# EAGLE design iMacG5-v2 (EAGLE 7.2.0)
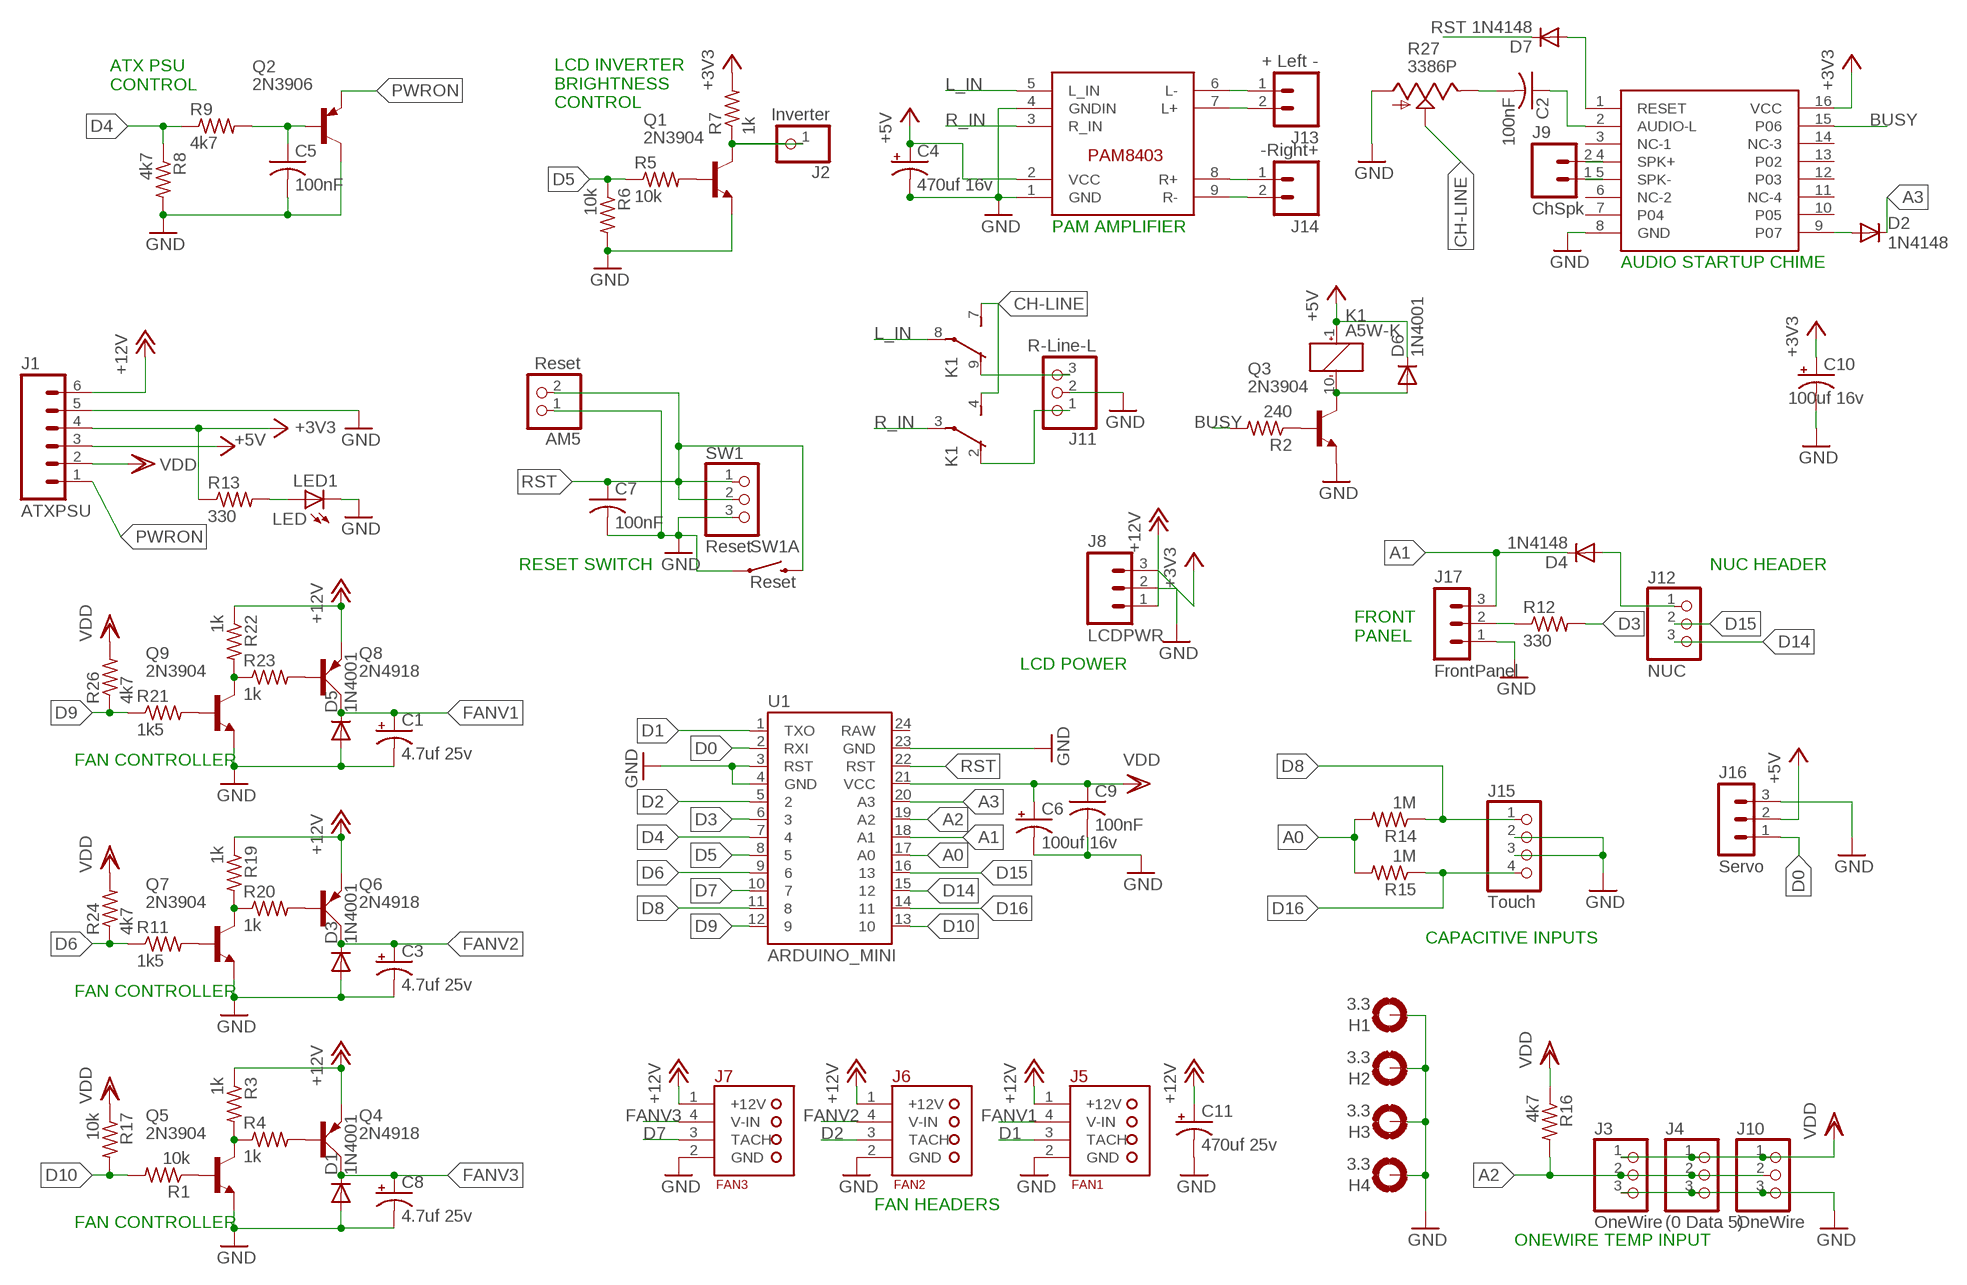
[diagram p0: schematic, sheet 1]

## Parts
AM5  Reset  PINHD-1X2  [1X02]
C1  4.7uf 25v  CPOL-USE2.5-5  [E2,5-5]
C2  100nF  C-US050-024X044  [C050-024X044]
C3  4.7uf 25v  CPOL-USE2.5-5  [E2,5-5]
C4  470uf 16v  CPOL-USE3.5-8  [E3,5-8]
C5  100nF  C-US050-024X044  [C050-024X044]
C6  100uf 16v  CPOL-USE2.5-5  [E2,5-5]
C7  100nF  C-US050-024X044  [C050-024X044]
C8  4.7uf 25v  CPOL-USE2.5-5  [E2,5-5]
C9  100nF  C-US050-024X044  [C050-024X044]
C10  100uf 16v  CPOL-USE2.5-5  [E2,5-5]
C11  470uf 25v  CPOL-USE3.5-8  [E3,5-8]
D1  1N4001  DIODE-D-2.5  [D-2.5]
D2  1N4148  DIODE-D-2.5  [D-2.5]
D3  1N4001  DIODE-D-2.5  [D-2.5]
D4  1N4148  DIODE-D-2.5  [D-2.5]
D5  1N4001  DIODE-D-2.5  [D-2.5]
D6  1N4001  DIODE-D-7.5  [D-7.5]
D7  1N4148  1N4148DO35-7  [DO35-7]
H1  3.3  MOUNT-PAD-ROUND3.3  [3,3-PAD]
H2  3.3  MOUNT-PAD-ROUND3.3  [3,3-PAD]
H3  3.3  MOUNT-PAD-ROUND3.3  [3,3-PAD]
H4  3.3  MOUNT-PAD-ROUND3.3  [3,3-PAD]
J1  ATXPSU  M06POLAR  [MOLEX-1X6]
J2  Inverter  PINHD-1X1  [1X01]
J3  OneWire  PINHD-1X3  [1X03]
J4  (0 Data 5)  PINHD-1X3  [1X03]
J5  FAN1  IMAC-G5-FAN-2X3IMAC_G5_1X4  [MOLEX-1X4]
J6  FAN2  IMAC-G5-FAN-2X3  [IMAC_G5_2X3]
J7  FAN3  IMAC-G5-FAN-2X3  [IMAC_G5_2X3]
J8  LCDPWR  M03POLAR  [MOLEX-1X3]
J9  ChSpk  M02POLAR  [MOLEX-1X2]
J10  OneWire  PINHD-1X3  [1X03]
J11  R-Line-L  PINHD-1X3  [1X03]
J12  NUC  PINHD-1X3  [1X03]
J13  + Left -  M02POLAR  [MOLEX-1X2]
J14  -Right+  M02POLAR  [MOLEX-1X2]
J15  Touch  PINHD-1X4  [1X04]
J16  Servo  MA03-1  [MA03-1]
J17  FrontPanel  MA03-1  [MA03-1]
K1  A5W-K  TQ2-5V  [TQ2]
LED1  LED  LED3MM  [LED3MM]
Q1  2N3904  [TO92]
Q2  2N3906  [TO92]
Q3  2N3904  [TO92]
Q4  2N4918  BD438  [TO126AV]
Q5  2N3904  [TO92]
Q6  2N4918  BD438  [TO126AV]
Q7  2N3904  [TO92]
Q8  2N4918  BD438  [TO126AV]
Q9  2N3904  [TO92]
R1  10k  R-US_0207/7  [0207/7]
R2  240  R-US_0207/2V  [0207/2V]
R3  1k  R-US_0207/2V  [0207/2V]
R4  1k  R-US_0207/2V  [0207/2V]
R5  10k  R-US_0207/2V  [0207/2V]
R6  10k  R-US_0207/2V  [0207/2V]
R7  1k  R-US_0207/2V  [0207/2V]
R8  4k7  R-US_0207/2V  [0207/2V]
R9  4k7  R-US_0207/2V  [0207/2V]
R11  1k5  R-US_0207/2V  [0207/2V]
R12  330  R-US_0207/2V  [0207/2V]
R13  330  R-US_0207/2V  [0207/2V]
R14  1M  R-US_0207/7  [0207/7]
R15  1M  R-US_0207/7  [0207/7]
R16  4k7  R-US_0207/7  [0207/7]
R17  10k  R-US_0207/7  [0207/7]
R19  1k  R-US_0207/2V  [0207/2V]
R20  1k  R-US_0207/2V  [0207/2V]
R21  1k5  R-US_0207/2V  [0207/2V]
R22  1k  R-US_0207/2V  [0207/2V]
R23  1k  R-US_0207/2V  [0207/2V]
R24  4k7  R-US_0207/2V  [0207/2V]
R26  4k7  R-US_0207/2V  [0207/2V]
R27  3386P  TRIM_US-B25P  [B25P]
SW1  Reset  PINHD-1X3  [1X03]
SW1A  Reset  SWITCH-MOMENTARY-2PTH  [TACTILE-PTH]
U1  ARDUINO_MINI  [ARDUINO_MINI]
U2  PAM8403  [PAM8403]
U3  WTV020-SD-16P  [WTV020-SD-16P]

## Nets
+3V3 [power]: C10.+ J1.4 J8.3 R7.2 R13.1 U3.16(VCC)
+5V [power]: C4.+ D6.C J1.3 J16.2 K1.1(_:+) U2.2(VCC)
+12V [power]: C11.+ J1.6 J5.1(+12V) J6.1(+12V) J7.1(+12V) J8.1 Q4.E Q6.E Q8.E R3.1 R19.1 R22.1
A0: R14.2 R15.2 U1.17(A0)
A1: D4.C J17.3 U1.18(A1)
A2: J3.2 J4.2 J10.2 R16.2 U1.19(A2)
A3: D2.C U1.20(A3)
BUSY: R2.2 U3.15(P06)
CH-LINE: K1.4(1:S) K1.7(2:S) R27.S
D0: J16.1 U1.2(RXI)
D1: J5.3(TACH) U1.1(TXO)
D2: J6.3(TACH) U1.5
D3: R12.2 U1.6
D4: R8.1 R9.1 U1.7
D5: R5.1 R6.1 U1.8
D6: R11.1 R24.1 U1.9
D7: J7.3(TACH) U1.10
D8: J15.1 R14.1 U1.11
D9: R21.1 R26.1 U1.12
D10: R1.2 R17.2 U1.13
D14: J12.3 U1.15
D15: J12.2 U1.16
D16: J15.4 R15.1 U1.14
FANV1: C1.+ D5.C J5.4(V-IN) Q8.C
FANV2 [power]: C3.+ D3.C J6.4(V-IN) Q6.C
FANV3 [power]: C8.+ D1.C J7.4(V-IN) Q4.C
GND [power]: AM5.1 C1.- C3.- C4.- C5.2 C6.- C7.2 C8.- C9.2 C10.- C11.- D1.A D3.A D5.A H1.B3,3(MOUNT) H2.B3,3(MOUNT) H3.B3,3(MOUNT) H4.B3,3(MOUNT) J1.5 J3.3 J4.3 J5.2(GND) J6.2(GND) J7.2(GND) J8.2 J10.3 J11.2 J15.2 J15.3 J16.3 J17.1 LED1.K(C) Q1.3(E) Q2.1(C) Q3.3(E) Q5.3(E) Q7.3(E) Q9.3(E) R6.2 R8.2 R27.A SW1.3 SW1A.1 U1.3(RST) U1.4(GND) U1.23(GND) U2.1(GND) U2.4(GNDIN) U3.8(GND)
L_IN: K1.8(2:P) U2.5(L_IN)
N$1: D4.A J12.1
N$2 [power]: D6.A K1.10(_:-) Q3.1(C)
N$3: Q1.2(B) R5.2
N$4: Q4.B R4.2
N$5: Q5.1(C) R3.2 R4.1
N$6: J2.1 Q1.1(C) R7.1
N$7: J9.1 U3.5(SPK-)
N$9: J9.2 U3.4(SPK+)
N$10: J17.2 R12.1
N$12: J14.1 U2.8(R+)
N$13: D7.A U3.1(RESET)
N$15: C2.2 R27.E
N$16: J14.2 U2.9(R-)
N$17: Q5.2(B) R1.1
N$18: J13.2 U2.7(L+)
N$19: Q6.B R20.2
N$20: LED1.A R13.2
N$21: J11.3 K1.9(2:O)
N$22: J11.1 K1.2(1:O)
N$23: Q3.2(B) R2.1
N$25: D2.A U3.9(P07)
N$26: J13.1 U2.6(L-)
N$27: Q7.1(C) R19.2 R20.1
N$28: Q7.2(B) R11.2
N$29: Q8.B R23.2
N$30: Q9.1(C) R22.2 R23.1
N$31: Q9.2(B) R21.2
N$32: C5.1 Q2.2(B) R9.2
N$33: C2.1 U3.2(AUDIO-L)
PWRON: J1.1 Q2.3(E)
R_IN: K1.3(1:P) U2.3(R_IN)
RST: AM5.2 C7.1 D7.C SW1.1 SW1.2 SW1A.3 U1.22(RST)
VDD [power]: C6.+ C9.1 J1.2 J3.1 J4.1 J10.1 R16.1 R17.1 R24.2 R26.2 U1.21(VCC)
Unconnected: U1.24(RAW) U3.3(NC-1) U3.6(NC-2) U3.7(P04) U3.10(P05) U3.11(NC-4) U3.12(P03) U3.13(P02) U3.14(NC-3)

## Notes on the sheet
- ATX PSU
  CONTROL
- LCD INVERTER
  BRIGHTNESS 
  CONTROL
- PAM AMPLIFIER
- AUDIO STARTUP CHIME
- RESET SWITCH | NUC HEADER
- FRONT
  PANEL
- LCD POWER
- FAN CONTROLLER
- CAPACITIVE INPUTS
- FAN CONTROLLER
- FAN HEADERS
- FAN CONTROLLER
- ONEWIRE TEMP INPUT

## Library data of the parts
AM5 = pinhead:PINHD-1X2: PIN HEADER
C1 C3 C4 C6 C8 C10 C11 = rcl:CPOL-US: POLARIZED CAPACITOR, American symbol
C2 C5 C7 C9 = rcl:C-US: CAPACITOR, American symbol
D1-D6 = diode:DIODE-: DIODE
D7 = diode:1N4148: DIODE high speed (Philips)
H1-H4 = holes:MOUNT-PAD-ROUND: MOUNTING PAD, round
J1 = SparkFun-Connectors:M06: Header 6 Standard 6-pin 0.1" header. Use with straight break away headers (SKU : PRT-00116), right angle break away headers (PRT-00553), swiss pins (PRT-00743), machine pins (PRT-00117), and female headers (PRT-00115). Molex polarized connector foot print use with SKU : PRT-08094 with associated crimp pins and housings. NOTES ON THE VARIANTS LOCK and LOCK_LONGPADS... This footprint was designed to help hold the alignment of a through-hole component (i.e. 6-pin header) while soldering it into place. You may notice that each hole has been shifted either up or down by 0.005 of an inch from it's more standard position (which is a perfectly straight line). This slight alteration caused the pins (the squares in the middle) to touch the edges of the holes. Because they are alternating, it causes a "brace" to hold the component in place. 0.005 has proven to be the perfect amount of "off-center" position when using our standard breakaway headers. Although looks a little odd when you look at the bare footprint, once you have a header in there, the alteration is very hard to notice. Also,if you push a header all the way into place, it is covered up entirely on the bottom side. This idea of altering the position of holes to aid alignment will be further integrated into the Sparkfun Library for other footprints. It can help hold any component with 3 or more connection pins.
J2 = pinhead:PINHD-1X1: PIN HEADER
J3 J4 J10-J12 SW1 = pinhead:PINHD-1X3: PIN HEADER
J5-J7 = 00_custom:IMAC-G5-FAN-2X3: Apple iMac G5 17 and 20 Inch Fan Connector
J8 = SparkFun-Connectors:M03: Header 3 Standard 3-pin 0.1" header. Use with straight break away headers (SKU : PRT-00116), right angle break away headers (PRT-00553), swiss pins (PRT-00743), machine pins (PRT-00117), and female headers (PRT-00115). Molex polarized connector foot print use with SKU : PRT-08232 with associated crimp pins and housings.
J9 J13 J14 = SparkFun-Connectors:M02: Standard 2-pin 0.1" header. Use with - straight break away headers ( PRT-00116) - right angle break away headers (PRT-00553) - swiss pins (PRT-00743) - machine pins (PRT-00117) - female headers (PRT-00115) Molex polarized connector foot print use with: PRT-08233 with associated crimp pins and housings. 2.54_SCREWTERM for use with PRT-10571. 3.5mm Screw Terminal footprints for PRT-08084 5mm Screw Terminal footprints for use with PRT-08432
J15 = pinhead:PINHD-1X4: PIN HEADER
J16 J17 = con-lstb:MA03-1: PIN HEADER; OC_FARNELL: unknown; OC_NEWARK: unknown
K1 = relay:TQ2?*: LOW PROFILE 2 FORM C RELAY NAiS Source: http://www.mew-europe.com/.. en_ds_61020_0001.pdf Source: http://www.mew-europe.com/.. en_ds_61020_0004.pdf; MF: AROMAT/ MATSUSHITA; MPN: TQ2-5V; OC_FARNELL: 1175716; OC_NEWARK: 64K3200
LED1 = led:LED: LED OSRAM: - CHIPLED LG R971, LG N971, LY N971, LG Q971, LY Q971, LO R971, LY R971 LH N974, LH R974 LS Q976, LO Q976, LY Q976 LO Q996 - Hyper CHIPLED LW Q18S LB Q993, LB Q99A, LB R99A - SideLED LS A670, LO A670, LY A670, LG A670, LP A670 LB A673, LV A673, LT A673, LW A673 LH A674 LY A675 LS A676, LA A676, LO A676, LY A676, LW A676 LS A679, LY A679, LG A679 - Hyper Micro SIDELED® LS Y876, LA Y876, LO Y876, LY Y876 LT Y87S - SmartLED LW L88C, LW L88S LB L89C, LB L89S, LG L890 LS L89K, LO L89K, LY L89K LS L896, LA L896, LO L896, LY L896 - TOPLED LS T670, LO T670, LY T670, LG T670, LP T670 LSG T670, LSP T670, LSY T670, LOP T670, LYG T670 LG T671, LOG T671, LSG T671 LB T673, LV T673, LT T673, LW T673 LH T674 LS T676, LA T676, LO T676, LY T676, LB T676, LH T676, LSB T676, LW T676 LB T67C, LV T67C, LT T67C, LS T67K, LO T67K, LY T67K, LW E67C LS E67B, LA E67B, LO E67B, LY E67B, LB E67C, LV E67C, LT E67C LW T67C LS T679, LY T679, LG T679 LS T770, LO T770, LY T770, LG T770, LP T770 LB T773, LV T773, LT T773, LW T773 LH T774 LS E675, LA E675, LY E675, LS T675 LS T776, LA T776, LO T776, LY T776, LB T776 LHGB T686 LT T68C, LB T68C - Hyper Mini TOPLED® LB M676 - Mini TOPLED Santana® LG M470 LS M47K, LO M47K, LY M47K Source: http://www.osram.convergy.de LUXEON: - LUMILED® LXK2-PW12-R00, LXK2-PW12-S00, LXK2-PW14-U00, LXK2-PW14-V00 LXK2-PM12-R00, LXK2-PM12-S00, LXK2-PM14-U00 LXK2-PE12-Q00, LXK2-PE12-R00, LXK2-PE12-S00, LXK2-PE14-T00, LXK2-PE14-U00 LXK2-PB12-K00, LXK2-PB12-L00, LXK2-PB12-M00, LXK2-PB14-N00, LXK2-PB14-P00, LXK2-PB14-Q00 LXK2-PR12-L00, LXK2-PR12-M00, LXK2-PR14-Q00, LXK2-PR14-R00 LXK2-PD12-Q00, LXK2-PD12-R00, LXK2-PD12-S00 LXK2-PH12-R00, LXK2-PH12-S00 LXK2-PL12-P00, LXK2-PL12-Q00, LXK2-PL12-R00 Source: www.luxeon.com KINGBRIGHT: KA-3528ASYC Source: www.kingbright.com
Q1 Q3 Q5 Q7 Q9 = transistor:2N3904: NPN TRANSISTOR
Q2 = transistor-pnp:2N3906: PNP Transistor
Q4 Q6 Q8 = transistor-power:BD438: PNP TRANSISTOR
R1 R14-R17 = rcl:R-US_: RESISTOR, American symbol
R2-R9 R11-R13 R19-R24 R26 = resistor:R-US_: RESISTOR, American symbol
R27 = pot:TRIM_US-: POTENTIOMETER
SW1A = SparkFun-Electromechanical:SWITCH-MOMENTARY-2: Various NO switches- pushbuttons, reed, etc
U1 = SparkFun-Boards:ARDUINO_MINI: Arduino Pro Mini footprint
U2 = 00_custom:PAM8403
U3 = 00_custom:WTV020-SD-16P

## Net classes
1 power: width 0.051 mm

## Board
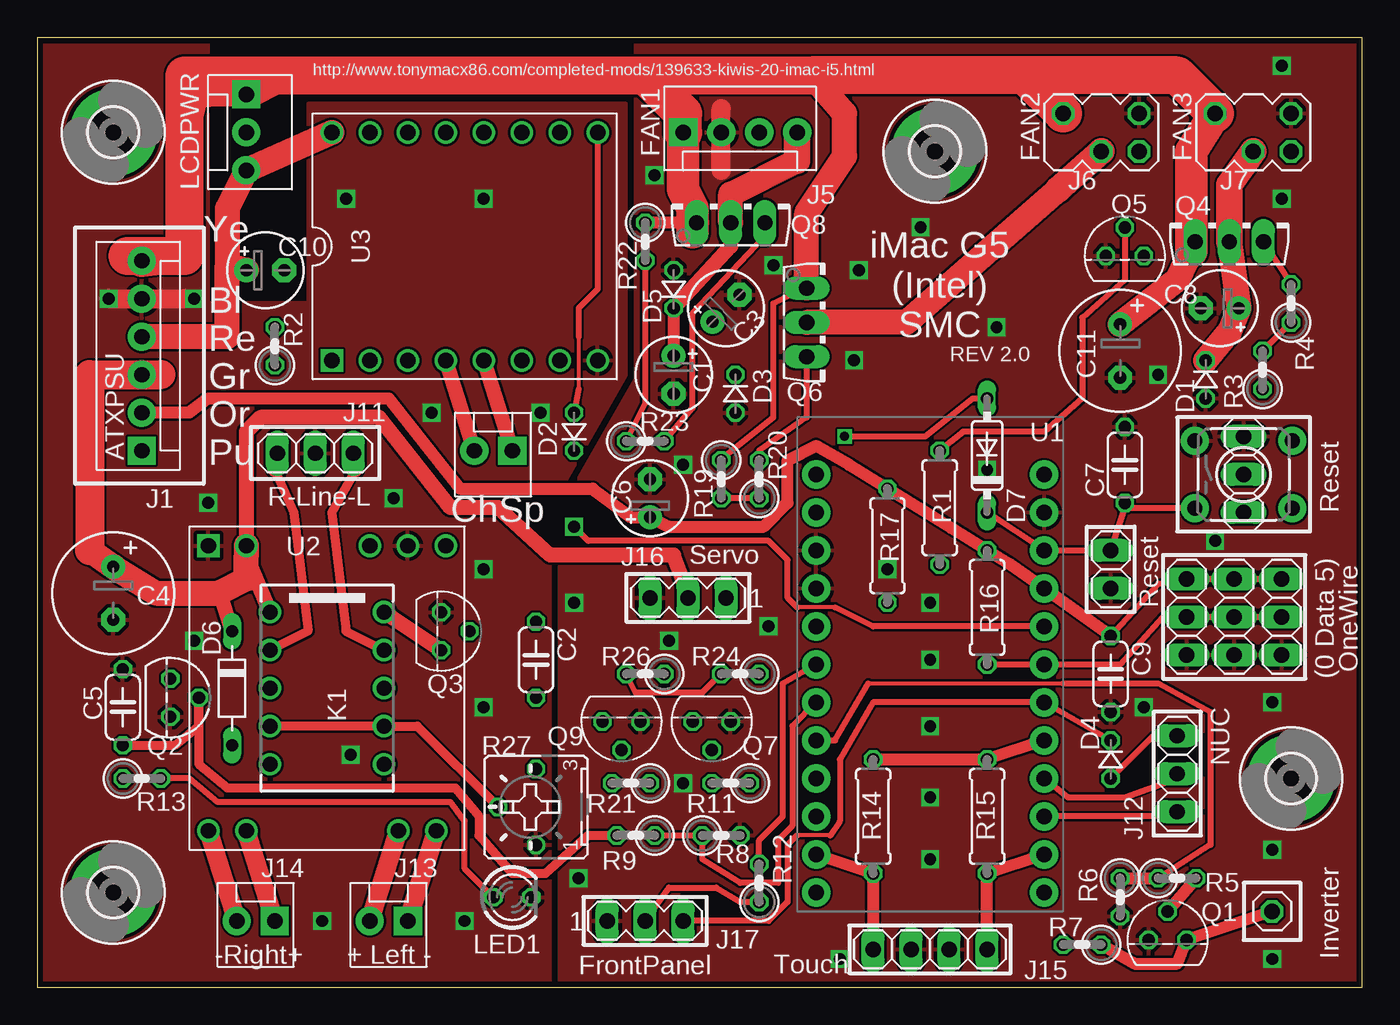
[diagram p1: board, top side]
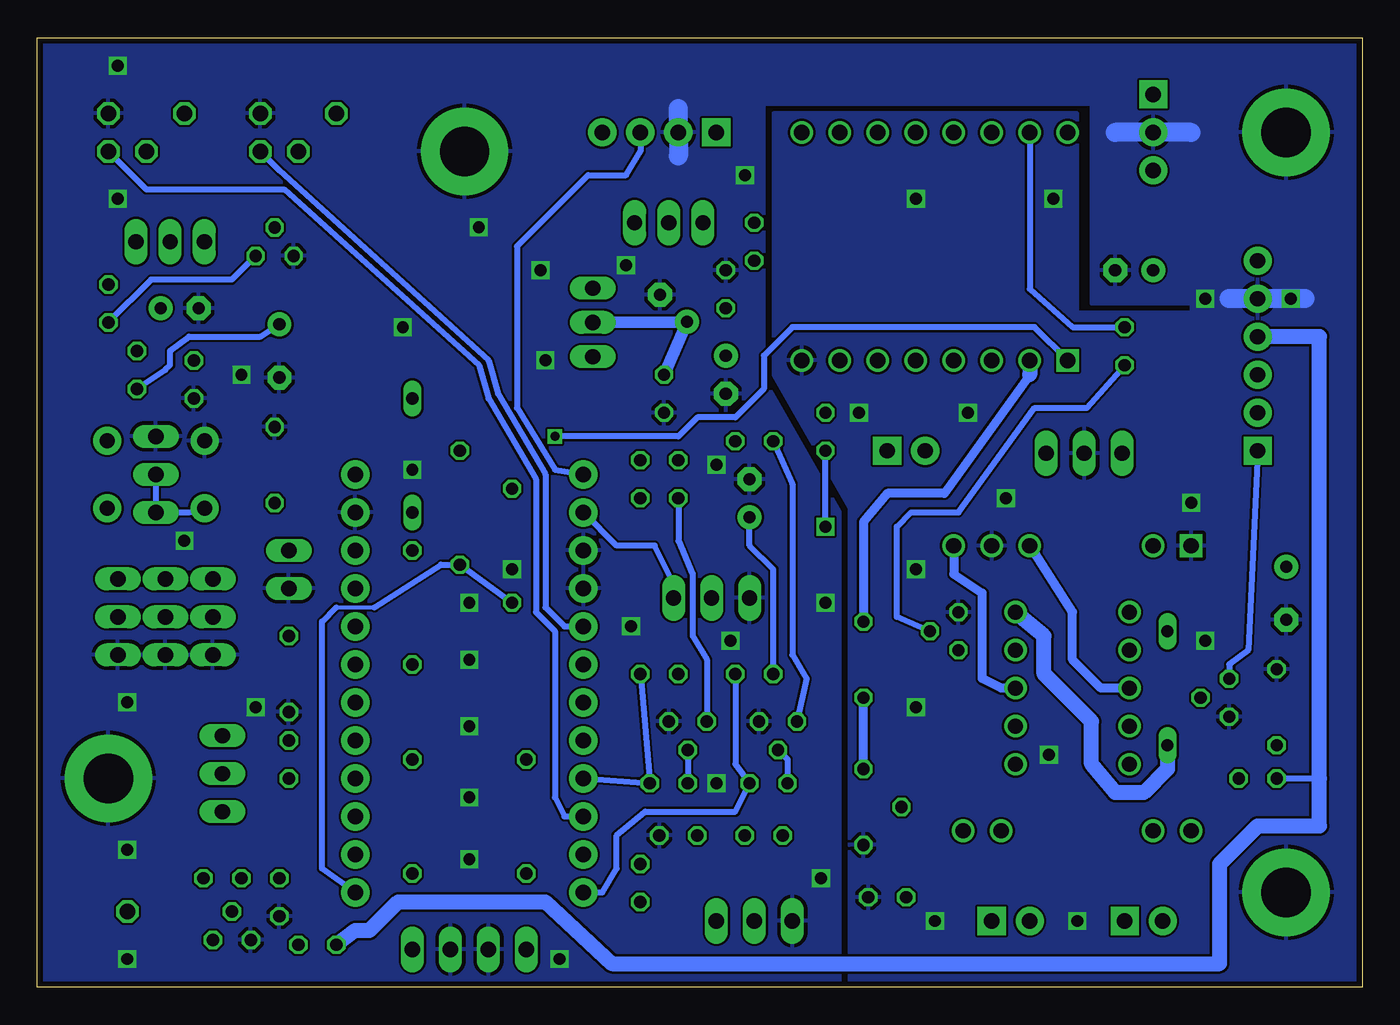
[diagram p2: board, bottom side, seen from below]

Size 88.57 x 63.49 mm. Coordinates in mm from the lower left corner, seen from the top.
Outline: 0,0 88.57,0 88.57,63.49 0,63.49 0,0
Copper layers (1*16): Top 0.0356mm / dielectric 1.5011mm / Bottom 0.0356mm
Design rules "default *": minimum track width 6mil, minimum drill 13mil, track to track 6mil, track to pad 6mil, pad to pad 6mil, via to via 6mil, smd to smd 6mil, copper to edge 15mil, drill to drill 6mil, minimum pad ring 7mil, minimum via ring 7mil, stop-mask expansion 3mil, vias tented up to drill 0mil, thermal gap 10mil

### Footprints (pad centres in the part's own frame; a part is rotated, then mirrored left to right if it is on the bottom)
1X02 = drill 1.016 long: 1 -1.27,0; 2 1.27,0
E2,5-5 = drill 0.813 pad 1.6: + -1.27,0 | drill 0.813 pad 1.6 octagon: - 1.27,0
C050-024X044 = drill 0.813 octagon: 1 -2.54,0; 2 2.54,0
E3,5-8 = drill 0.813 pad 1.6: + -1.778,0 | drill 0.813 pad 1.6 octagon: - 1.778,0
D-2.5 = drill 0.813 octagon: A 1.27,0; C -1.27,0
D-7.5 = drill 0.813 long: A 3.81,0; C -3.81,0
DO35-7 = drill 0.813 long: A 3.81,0; C -3.81,0
3,3-PAD = drill 3.3 pad 5.842: B3,3 0,0
MOLEX-1X6 = drill 1.016 pad 1.88 square: 1 0,0 | drill 1.016 pad 1.88: 2 2.54,0; 3 5.08,0; 4 7.62,0; 5 10.16,0; 6 12.7,0
1X01 = drill 1.016 octagon: 1 0,0
1X03 = drill 1.016 long: 1 -2.54,0; 2 0,0; 3 2.54,0
MOLEX-1X4 = drill 1.016 pad 1.88 square: 1 0,0 | drill 1.016 pad 1.88: 2 2.54,0; 3 5.08,0; 4 7.62,0
IMAC_G5_2X3 = drill 1.016 octagon: 1 -2.54,1.27; 2 2.54,1.27; 3 2.54,-1.27; 4 0,-1.27
MOLEX-1X3 = drill 1.016 pad 1.88 square: 1 0,0 | drill 1.016 pad 1.88: 2 2.54,0; 3 5.08,0
MOLEX-1X2 = drill 1.016 pad 1.88 square: 1 0,0 | drill 1.016 pad 1.88: 2 2.54,0
1X04 = drill 1.016 long: 1 -3.81,0; 2 -1.27,0; 3 1.27,0; 4 3.81,0
MA03-1 = drill 1.016 long: 1 -2.54,0; 2 0,0; 3 2.54,0
TQ2 = drill 1: 1 -5.08,-3.81; 2 -2.54,-3.81; 3 0,-3.81; 4 2.54,-3.81; 5 5.08,-3.81; 6 5.08,3.81; 7 2.54,3.81; 8 0,3.81; 9 -2.54,3.81; 10 -5.08,3.81
LED3MM = drill 0.813 octagon: A -1.27,0; K 1.27,0
TO92 = drill 0.813 octagon: 1 1.27,0; 2 0,1.905; 3 -1.27,0
TO126AV = drill 1.016 long: B 2.286,-1.27; C 0,-1.27; E -2.286,-1.27
0207/7 = drill 0.813 octagon: 1 -3.81,0; 2 3.81,0
0207/2V = drill 0.813 octagon: 1 -1.27,0; 2 1.27,0
B25P = drill 0.813 octagon: A -2.54,0; E 2.54,0; S 0,2.54
TACTILE-PTH = drill 1.016 pad 1.88: 1 -3.251,2.261; 2 3.251,2.261; 3 -3.251,-2.261; 4 3.251,-2.261
ARDUINO_MINI = drill 1.016 pad 1.88: 1 -7.62,12.7; 2 -7.62,10.16; 3 -7.62,7.62; 4 -7.62,5.08; 5 -7.62,2.54; 6 -7.62,0; 7 -7.62,-2.54; 8 -7.62,-5.08; 9 -7.62,-7.62; 10 -7.62,-10.16; 11 -7.62,-12.7; 12 -7.62,-15.24; 13 7.62,-15.24; 14 7.62,-12.7; 15 7.62,-10.16; 16 7.62,-7.62; 17 7.62,-5.08; 18 7.62,-2.54; 19 7.62,0; 20 7.62,2.54; 21 7.62,5.08; 22 7.62,7.62; 23 7.62,10.16; 24 7.62,12.7
PAM8403 = drill 1.016 square: 1 -7.62,8.89 | drill 1.016: 2 -5.08,8.89; 3 3.175,8.89; 4 5.715,8.89; 5 8.255,8.89; 6 7.62,-10.16; 7 5.08,-10.16; 8 -5.08,-10.16; 9 -7.62,-10.16
WTV020-SD-16P = drill 1.016 square: 1 -7.62,8.89 | drill 1.016: 2 -7.62,6.35; 3 -7.62,3.81; 4 -7.62,1.27; 5 -7.62,-1.27; 6 -7.62,-3.81; 7 -7.62,-6.35; 8 -7.62,-8.89; 9 7.62,-8.89; 10 7.62,-6.35; 11 7.62,-3.81; 12 7.62,-1.27; 13 7.62,1.27; 14 7.62,3.81; 15 7.62,6.35; 16 7.62,8.89

### Placement (x,y rotation side)
AM5  71.75,27.94 90 top
C1  42.55,40.96 270 top
C2  33.34,21.91 270 top
C3  46.04,45.4 45 top
C4  5.08,26.35 270 top
C5  5.71,18.73 90 top
C6  40.96,32.7 90 top
C7  72.71,34.92 90 top
C8  79.06,45.4 180 top
C9  71.75,20.95 270 top
C10  15.24,47.94 0 top
C11  72.39,42.55 270 top
D1  78.11,40.64 270 top
D2  35.88,37.15 90 top
D3  46.67,39.69 270 top
D4  71.75,15.24 270 top
D5  42.55,46.67 90 top
D6  13.02,20 270 top
D7  63.5,35.56 90 top
H1  5.08,6.35 0 top
H2  83.82,13.97 0 top
H3  5.08,57.15 0 top
H4  60.01,55.88 0 top
J1  6.99,35.88 90 top
J2  82.55,5.08 0 top
J3  76.83,24.77 270 top
J4  80.01,24.77 270 top
J5  43.18,57.15 0 top
J6  71.12,57.15 0 top
J7  81.28,57.15 0 top
J8  13.97,59.69 270 top
J9  31.75,35.88 180 top
J10  83.19,24.77 270 top
J11  18.58,35.7 0 top
J12  76.2,14.29 270 top
J13  24.77,4.45 180 top
J14  15.88,4.45 180 top
J15  59.69,2.54 0 top
J16  43.5,26.04 180 top
J17  40.64,4.45 0 top
K1  19.37,20 270 top
LED1  31.75,6.03 0 top
Q1  75.56,3.17 0 top
Q2  8.89,19.37 270 top
Q3  26.99,23.81 270 top
Q4  79.69,51.12 0 top
Q5  72.71,48.9 0 top
Q6  52.7,44.45 270 top
Q7  45.09,17.78 180 top
Q8  46.35,52.39 0 top
Q9  39.05,17.78 180 top
R1  60.33,32.07 270 top
R2  15.88,42.86 90 top
R3  81.92,41.27 90 top
R4  83.82,45.72 90 top
R5  76.2,7.3 0 top
R6  72.39,6.03 270 top
R7  69.85,2.86 180 top
R8  45.72,10.16 0 top
R9  40.01,10.16 180 top
R11  46.35,13.65 180 top
R12  48.26,6.99 90 top
R13  6.99,13.97 0 top
R14  55.88,11.43 90 top
R15  63.5,11.43 90 top
R16  63.5,25.4 270 top
R17  56.83,29.53 270 top
R19  45.72,33.97 270 top
R20  48.26,33.97 90 top
R21  39.69,13.65 180 top
R22  40.64,49.85 270 top
R23  40.64,36.51 0 top
R24  46.99,20.95 180 top
R26  40.64,20.95 180 top
R27  33.34,12.06 90 top
SW1  80.64,34.29 90 top
SW1A  80.64,34.29 0 top
U1  59.69,21.59 0 top
U2  19.05,20.64 0 top
U3  28.57,49.53 90 top

### Tracks (layer width: path | path; a pad name or v marks a point on that pad's centre or on a via)
+3V3
  Top 1.676: 12.7,48.26 12.7,43.5 J1.4 | C10.+ 12.7,48.26 | U3.16 J8.3 12.7,52.07 12.7,48.26
  Bottom 0.406: R13.1 2.86,13.97
  Bottom 1.016: R7.2 67.31,3.81 66.36,3.81 64.45,5.71 54.61,5.71 50.16,1.59 9.53,1.59 9.53,8.26 6.99,10.79 2.86,10.79 2.86,13.97 2.86,43.5 J1.4
+5V
  Top 0.813: J16.2 43.5,26.35
  Top 1.016: 43.5,26.35 42.55,28.89 34.29,28.89 30.8,32.07 27.62,32.07 22.86,38.1 14.92,38.1 13.97,37.15 U2.2 | K1.1 13.97,28.89 | D6.C 12.19,26.42
  Top 1.676: 3.49,29.21 C4.+ 7.94,26.35 12.06,26.35 12.19,26.42 13.97,27.3 13.97,28.89 U2.2
  Top 1.93: 3.49,29.21 3.49,40.96 J1.3 8.26,40.96
+12V
  Top 0.406: R19.1 46.04,35.56 49.21,38.1 49.21,45.72 50.48,46.35 Q6.E
  Top 0.813: Q8.E R22.1
  Top 1.676: 43.81,50.48 Q8.E | 77.15,49.21 Q4.E 76.2,47.31 C11.+ | Q6.E 51.44,51.75 53.98,55.56 53.98,58.42 51.75,60.96 | 11.43,59.69 J8.1 13.97,60.01
  Top 2.184: 9.84,48.9 J1.6 | 43.81,50.48 43.81,52.07 43.18,53.34 J5.1 | 77.15,49.21 77.15,55.88 J7.1
  Top 2.54: 10.16,59.69 9.84,58.42 | 15.88,60.96 40.64,60.96 | 40.64,60.96 51.75,60.96 66.04,60.96 | 66.04,60.96 76.2,60.96 J7.1 | 6.03,48.9 9.84,48.9 9.84,58.42 | 9.84,58.42 9.84,60.96 15.88,60.96 | 13.97,60.01 15.88,60.96 | J6.1 66.04,60.96 | J5.1 43.18,58.42 40.64,60.96
  Bottom 0.406: R3.1 80.01,41.27 79.69,41.59 79.69,42.55 78.42,43.5 73.66,43.5 C11.+
A0
  Top 0.813: U1.17 R15.2 R14.2
A1
  Top 0.254: 53.02,10.16 50.8,10.16
  Top 0.406: 53.02,10.16 53.66,11.11 53.66,15.24 55.88,19.05 U1.18 D4.C | 50.8,10.16 50.16,9.53 50.16,5.71 48.9,4.45 J17.3
A2
  Top 0.406: J10.2 J4.2 J3.2 75.25,24.77 72.39,21.59 U1.19 R16.2
A3  (via drill 0.8)
  Top 0.254: 53.34,25.4 50.8,25.4
  Top 0.406: U1.20 55.88,24.13 53.34,25.4 | 50.8,25.4 50.16,26.04 50.16,28.57 48.9,29.84 36.83,29.84 v35.88,30.8
  Bottom 0.406: v35.88,30.8 D2.C
BUSY
  Bottom 0.406: R2.2 19.37,44.13 22.23,46.67 U3.15
CH-LINE
  Top 0.61: K1.4 K1.7 25.4,17.46 R27.S
D0
  Bottom 0.406: J16.1 46.04,26.99 47.31,29.53 49.85,29.53 U1.2
D1
  Bottom 0.406: U1.1 53.98,34.61 56.52,38.73 56.52,49.53 51.75,54.29 49.21,54.29 48.26,55.88 J5.3
D2
  Bottom 0.406: U1.5 53.34,24.13 54.61,25.4 54.61,34.29 57.78,39.69 58.42,41.91 72.39,54.61 J6.3
D3
  Top 0.406: R12.2 48.26,9.84 49.85,11.43 49.85,20.32 U1.6
D4
  Top 0.406: U1.7 50.48,17.46 50.48,10.79 49.53,9.84 49.53,6.99 46.99,6.99 44.45,8.57 R8.1 R9.1
D5
  Top 0.254: 55.56,20.32 68.58,20.32
  Top 0.406: U1.8 53.34,16.51 55.56,20.32 | 68.58,20.32 74.93,20.32 78.42,18.41 78.42,9.53 R5.1
  Top 0.813: R6.1 R5.1
D6
  Bottom 0.406: U1.9 R11.1 R24.1
D7
  Bottom 0.406: U1.10 53.34,11.43 53.98,12.7 53.98,23.81 55.24,25.08 55.24,33.97 58.42,39.37 59.05,41.59 72.07,53.34 81.28,53.34 J7.3
D8
  Top 0.813: U1.11 R14.1 J15.1
D9
  Bottom 0.406: R26.1 41.91,14.92 R21.1 41.91,11.75 47.94,11.75 49.85,10.16 49.85,7.94 50.8,6.35 U1.12
D10
  Bottom 0.254: 68.58,25.4 66.04,25.4
  Bottom 0.406: U1.13 69.53,7.94 69.53,24.45 68.58,25.4 | 66.04,25.4 61.59,28.26 R1.2 R17.2
D14
  Top 0.406: J12.3 74.61,11.43 U1.15
D15
  Top 0.406: U1.16 68.9,12.7 72.71,12.7 76.2,13.97 J12.2
D16
  Top 0.813: J15.4 R15.1 U1.14
FANV1
  Top 0.813: D5.C C1.+
  Top 1.016: Q8.C 46.35,49.53 D5.C
  Top 1.676: Q8.C 46.35,53.02 50.8,55.24
  Top 1.778: J5.4 50.8,55.24
FANV2
  Top 1.676: 68.26,53.34 58.1,44.45 Q6.C
  Top 1.778: J6.4 68.26,53.34
  Bottom 0.813: Q6.C C3.+ D3.C
FANV3
  Top 1.676: Q4.C C8.+ 79.69,43.81 D1.C
  Top 1.778: J7.4 79.69,53.66 Q4.C
GND  (via drill 0.8)
  Top 1.27: v4.76,46.04 9.84,46.04 | 45.72,54.61 45.72,58.74
  Bottom 1.27: 11.43,57.15 16.51,57.15 | 3.81,46.04 8.89,46.04 | 45.72,58.74 J5.2 45.72,55.56
  other vias: 59.69,25.72 29.84,27.94 20.64,52.7 29.84,18.73 19.05,4.45 11.43,32.38 26.35,38.42 78.74,29.84 54.93,47.94 41.27,54.29 29.84,52.7 28.57,4.45 59.69,12.7 82.55,1.91 59.05,50.8 73.98,18.73 36.2,7.3 53.66,1.91 59.69,8.57 56.83,27.94 63.5,34.61 49.21,48.26 35.88,25.72 82.55,9.21 59.69,17.46 54.61,41.91 20.95,15.56 83.19,61.59 10.48,46.04 59.69,21.91 23.81,32.7 43.18,34.92 74.93,40.96 83.19,52.7 64.14,44.13 82.55,19.05 33.66,38.42 42.23,23.18 48.9,24.13 43.18,13.65 10.48,23.18
  pour Bottom: 40.01,59.05 18.1,59.05 18.1,45.72 -1.91,45.72 -1.91,64.77 90.17,64.77 90.17,-1.27 34.92,-1.27 34.92,31.75 40.01,40.64
  pour Top: 40.01,64.14 40.01,40.64 34.92,31.75 34.92,-0.64 89.53,-0.64 89.53,64.14
  pour Bottom: 34.29,-1.27 -2.54,-1.27 -2.54,47.94 11.43,47.94 11.43,45.09 19.05,45.09 19.05,58.42 39.37,58.42 39.37,40.96 34.29,32.07
  pour Top: -1.27,-0.64 34.29,-0.64 34.29,32.07 39.37,40.96 39.37,59.05 18.1,59.05 18.1,45.72 11.43,45.72 11.43,63.82 -1.27,63.82
L_IN
  Bottom 0.61: K1.8 24.13,20 25.4,20.64 25.4,26.35 27.3,27.62 U2.5
N$1
  Top 0.406: D4.A 74.61,16.83 J12.1
N$2
  Top 1.016: Q3.1 K1.10
  Bottom 1.016: D6.A 13.02,14.61 14.61,13.02 16.51,13.02 18.1,14.92 18.1,17.78 21.27,20.95 21.27,23.5 K1.10
N$3
  Top 0.813: Q1.2 R5.2
N$4
  Top 0.406: Q4.B R4.2
N$5
  Top 0.406: R4.1 R3.2
  Bottom 0.406: Q5.1 75.56,47.31 80.96,47.31 R4.1
N$6
  Top 0.813: J2.1 Q1.1 76.2,1.59 73.34,1.59 R7.1
N$7
  Top 1.016: U3.5 J9.1
N$9
  Top 1.016: U3.4 J9.2
N$10
  Top 0.406: J17.2 42.23,6.67 45.4,6.67 46.99,5.71 R12.1
N$12
  Top 1.27: J14.1 U2.8
N$13  (via drill 0.6)
  Top 0.406: v53.98,36.83 59.37,36.83 62.55,39.37 D7.A
  Bottom 0.406: U3.1 21.91,44.13 38.1,44.13 40.01,42.23 40.01,40.01 41.91,38.1 44.45,38.1 45.72,36.83 v53.98,36.83
N$15
  Bottom 0.61: R27.E C2.2
N$16
  Top 1.27: U2.9 J14.2
N$17
  Top 0.406: Q5.2 72.71,47.31 69.85,44.77 69.85,39.37 67.31,37.15 61.91,37.15 R1.1
N$18
  Top 1.27: U2.7 J13.2
N$19
  Top 0.406: Q6.B 51.44,38.1 48.26,35.88 R20.2
N$20
  Top 0.406: LED1.A 28.57,7.94 28.57,11.11 27.62,12.38 12.06,12.38 10.16,13.97 R13.2
N$21
  Top 0.61: 21.27,34.61 19.68,31.75 20.64,23.81 K1.9
  Top 1.016: J11.3 21.27,34.61
N$22
  Top 0.61: 15.88,34.61 17.14,31.75 18.1,23.81 K1.2
  Top 1.016: J11.1 15.88,34.61
N$23
  Bottom 0.406: Q3.2 31.11,24.77 31.11,30.8 30.16,31.75 26.99,31.75 21.91,38.73 18.41,38.73 R2.1
N$25
  Top 0.254: 36.2,43.5 36.2,40.01
  Top 0.406: 36.2,43.5 36.2,45.4 37.47,46.67 U3.9 | 36.2,40.01 D2.A
N$26
  Top 1.27: U2.6 J13.1
N$27
  Top 0.406: R20.1 R19.2
  Bottom 0.406: R19.2 45.72,29.84 44.77,27.62 44.77,23.5 43.81,21.91 Q7.1
N$28
  Bottom 0.406: Q7.2 R11.2
N$29
  Top 0.406: R23.2 43.81,38.73 43.81,45.09 48.58,50.16 Q8.B
N$30
  Top 0.406: R22.2 40.64,39.05 R23.1
  Bottom 0.406: R23.1 38.1,33.66 38.1,22.23 37.15,20.64 Q9.1
N$31
  Bottom 0.406: Q9.2 38.42,15.24 R21.2
N$32
  Top 0.61: C5.1 9.21,16.19 10.79,17.46 Q2.2 10.79,14.92 12.7,13.34 27.94,13.34 29.53,11.43 29.53,10.16 31.75,7.62 33.97,7.62 36.83,10.16 R9.2
N$33
  Bottom 0.61: 22.23,40.96 27.94,33.02 31.75,33.02 33.34,31.11 C2.1
  Bottom 1.016: U3.2 22.23,40.96
PWRON
  Bottom 0.406: J1.1 7.62,22.54 8.89,21.59 Q2.3
R_IN
  Bottom 0.61: K1.3 17.46,20 19.37,21.91 19.37,25.08 U2.3
RST
  Top 0.406: SW1A.3 72.71,32.03 | 72.71,32.03 AM5.2 U1.22 D7.C | 72.71,32.03 C7.1
  Bottom 0.406: SW1.2 SW1.1 78.42,31.75 SW1A.3
VDD
  Top 0.406: J10.1 J4.1 J3.1 74.93,26.99 C9.1 | R16.1 61.11,30.72 | R17.1 58.13,32.55 | R24.2 44.45,19.68 40.01,19.68 R26.2
  Top 0.813: C9.1 U1.21 65.09,28.26 61.11,30.72 58.13,32.55 54.29,34.92 52.07,36.2 50.16,35.24 50.16,32.38 48.58,30.8 42.23,30.8 C6.+ 39.69,31.43 37.13,33.31 37.15,33.34 28.26,33.34 23.5,39.37 11.43,39.37 10.16,38.42 J1.2
  Bottom 0.406: R26.2 39.37,27.94 40.96,29.53 C6.+

### Text on the board
tPlace: http://www.tonymacx86.com/completed-mods/139633-kiwis-20-imac-i5.html | LCDPWR | Ye | iMac G5 / (Intel) / SMC | Bl | Re | REV 2.0 | Gr | Or | Pu | ChSp